# EAGLE design ECE411-Group6-V3 (EAGLE 8.3.2)
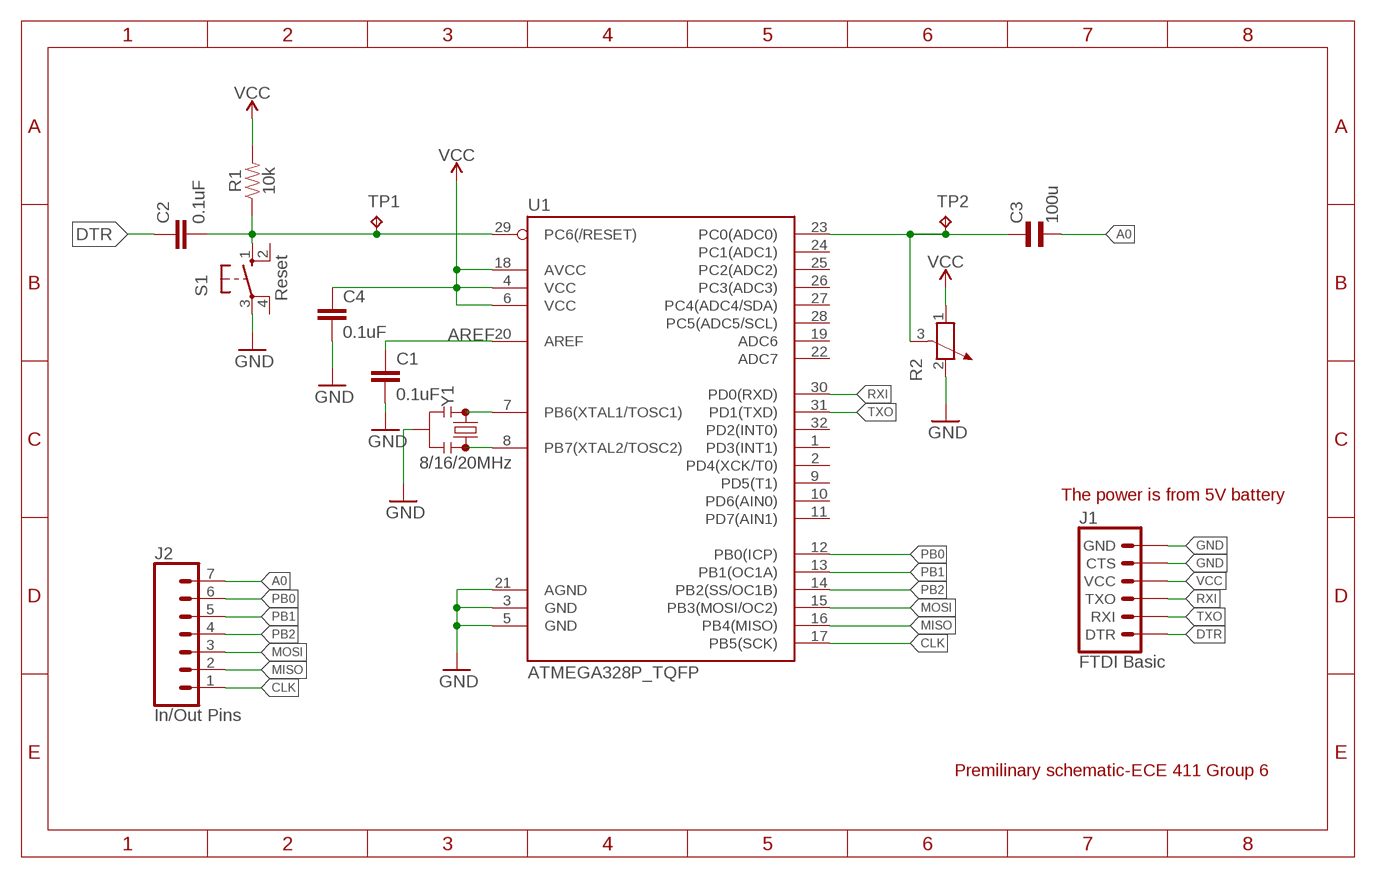
[diagram p0: schematic, sheet 1]

## Parts
C1  0.1uF  0.1UF-0603-25V-5%  [0603]
C2  0.1uF  0.1UF-0603-25V-5%  [0603]
C3  100u  EL-BI25-10AXIAL  [EU25-10]
C4  0.1uF  0.1UF-0603-25V-5%  [0603]
J1  FTDI Basic  6_PIN_SERIAL_TARGET  [1X06]
J2  In/Out Pins  CONN_07  [1X07]
R1  10k  10KOHM-0603-1/10W-1%  [0603]
R2  POTENTIOMETER_PT-10  [PT-10]
S1  Reset  10-XX  [B3F-10XX]
TP1  TPB1,27  [B1,27]
TP2  TPB1,27  [B1,27]
U1  ATMEGA328P_TQFP  [TQFP32-08]
Y1  8/16/20MHz  RESONATORSMD-3.2X1.3  [RESONATOR-SMD-3.2X1.3]

## Nets
A0: C3.2 J2.7
AREF: C1.1 U1.20(AREF)
CLK: J2.1 U1.17(PB5(SCK))
DTR: C2.1 J1.1(DTR)
GND: C1.2 C4.2 J1.5(CTS) J1.6(GND) R2.2 S1.3(P) U1.3(GND) U1.5(GND) U1.21(AGND) Y1.2
MISO: J2.2 U1.16(PB4(MISO))
MOSI: J2.3 U1.15(PB3(MOSI/OC2))
N$1: U1.7(PB6(XTAL1/TOSC1)) Y1.1
N$2: U1.8(PB7(XTAL2/TOSC2)) Y1.3
N$3: C2.2 R1.1 S1.1(S) TP1.TP U1.29(PC6(/RESET))
N$4: C3.1 R2.3 TP2.TP U1.23(PC0(ADC0))
PB0: J2.6 U1.12(PB0(ICP))
PB1: J2.5 U1.13(PB1(OC1A))
PB2: J2.4 U1.14(PB2(SS/OC1B))
RXI: J1.3(TXO) U1.30(PD0(RXD))
TXO: J1.2(RXI) U1.31(PD1(TXD))
VCC: C4.1 J1.4(VCC) R1.2 R2.1 U1.4(VCC) U1.6(VCC) U1.18(AVCC)
Unconnected: S1.2(S1) S1.4(P1) U1.1(PD3(INT1)) U1.2(PD4(XCK/T0)) U1.9(PD5(T1)) U1.10(PD6(AIN0)) U1.11(PD7(AIN1)) U1.19(ADC6) U1.22(ADC7) U1.24(PC1(ADC1)) U1.25(PC2(ADC2)) U1.26(PC3(ADC3)) U1.27(PC4(ADC4/SDA)) U1.28(PC5(ADC5/SCL)) U1.32(PD2(INT0))

## Notes on the sheet
- The power is from 5V battery
- Premilinary schematic-ECE 411 Group 6

## Library data of the parts
C1 C2 C4 = SparkFun-Capacitors:0.1UF: 0.1µF ceramic capacitors A capacitor is a passive two-terminal electrical component used to store electrical energy temporarily in an electric field.; PROD_ID: CAP-08604
C3 = rcl:EL-: BIPOLAR ELECTROLYTIC CAPACITOR
J1 = SparkFun-Connectors:6_PIN_SERIAL_TARGET: 6-pin header connection for use with the "FTDI BASIC" pinout - TARGET SIDE. Also known as "Arduino Serial Program Header". It is used to mate with our FTDI Basic serial programmers using the Arduino IDE. Note, this device has "TARGET" in the name. It is intended to be used on a design that contains a target micro-controller that you wish to program. The "sister" device, named "CABLE" is inteneded to be used on a design that usually lives on the end of your USB cable and prvides the converter chip (FTDI232 or FTDI231x) to commnicate serial RX/TX. You can populate with some of these: Break Away Headers - Straight <https://www.sparkfun.com/products/116> (PRT-00116) For reference (or to suit your programming needs) check out these designs: SparkFun FTDI Basic Breakout - 5V <https://www.sparkfun.com/products/9716> (DEV-09716) SparkFun FTDI Basic Breakout - 3.3V <https://www.sparkfun.com/products/9873> (DEV-09873) SparkFun FTDI SmartBasic <https://www.sparkfun.com/products/12935> (DEV-12935) SparkFun Beefy 3 - FTDI Basic Breakout <https://www.sparkfun.com/products/13746> (DEV-13746)
J2 = SparkFun-Connectors:CONN_07: Multi connection point. Often used as Generic Header-pin footprint for 0.1 inch spaced/style header connections On any of the 0.1 inch spaced packages, you can populate with these: Break Away Headers - Straight <https://www.sparkfun.com/products/116> (PRT-00116) Break Away Male Headers - Right Angle <https://www.sparkfun.com/products/553> (PRT-00553) Female Headers <https://www.sparkfun.com/products/115> (PRT-00115) Break Away Headers - Machine Pin <https://www.sparkfun.com/products/117> (PRT-00117) Break Away Female Headers - Swiss Machine Pin <https://www.sparkfun.com/products/743> (PRT-00743) For SCREWTERMINALS and SPRING TERMINALS visit here: Screw Terimnals on SparkFun.com <https://www.sparkfun.com/search/results?term=Screw+Terminals> (5mm/3.5mm/2.54mm spacing) This device is also useful as a general connection point to wire up your design to another part of your project. Our various solder wires solder well into these plated through hole pads. Hook-Up Wire - Assortment (Stranded, 22 AWG) <https://www.sparkfun.com/products/11375> (PRT-11375) Hook-Up Wire - Assortment (Solid Core, 22 AWG) <https://www.sparkfun.com/products/11367> (PRT-11367) View the entire wire category on our website here <https://www.sparkfun.com/categories/141> Special notes: Molex polarized connector foot print use with SKU : PRT-08231 with associated crimp pins and housings. 1MM SMD Version SKU: PRT-10208 NOTES ON THE VARIANTS LOCK and LOCK_LONGPADS... This footprint was designed to help hold the alignment of a through-hole component (i.e. 6-pin header) while soldering it into place. You may notice that each hole has been shifted either up or down by 0.005 of an inch from it's more standard position (which is a perfectly straight line). This slight alteration caused the pins (the squares in the middle) to touch the edges of the holes. Because they are alternating, it causes a "brace" to hold the component in place. 0.005 has proven to be the perfect amount of "off-center" position when using our standard breakaway headers. Although looks a little odd when you look at the bare footprint, once you have a header in there, the alteration is very hard to notice. Also,if you push a header all the way into place, it is covered up entirely on the bottom side.
R1 = SparkFun-Resistors:10KOHM: 10kΩ resistor A resistor is a passive two-terminal electrical component that implements electrical resistance as a circuit element. Resistors act to reduce current flow, and, at the same time, act to lower voltage levels within circuits. - Wikipedia; PROD_ID: RES-00824
R2 = rcl:POTENTIOMETER_: Potentiometer
S1 = switch-omron:10-XX: OMRON SWITCH; MPN: B3F-1000; OC_FARNELL: 176432; OC_NEWARK: 36M3542
TP1 TP2 = testpad:TP: Test pad
U1 = SparkFun-IC-Microcontroller:ATMEGA328P_TQFP: Popular 328P in QFP Storefront component: ATmega328 - TQFP <https://www.sparkfun.com/products/13448> (COM-13448) Datasheet <http://www.sparkfun.com/datasheets/Components/SMD/ATMega328.pdf> SparkFun Products SparkFun RedBoard - Programmed with Arduino <https://www.sparkfun.com/products/12757> (DEV-12757) Arduino Pro Mini 328 - 5V/16MHz <https://www.sparkfun.com/products/11113> (DEV-11113) Arduino Pro Mini 328 - 3.3V/8MHz <https://www.sparkfun.com/products/11114> (DEV-11114) SparkFun OpenLog <https://www.sparkfun.com/products/13712> (DEV-13712) SparkFun MicroView - OLED Arduino Module <https://www.sparkfun.com/products/12923> (DEV-12923) SparkFun Digital Sandbox <https://www.sparkfun.com/products/12651> (DEV-12651) SparkFun PicoBoard <https://www.sparkfun.com/products/11888> (WIG-11888) Arduino Fio <https://www.sparkfun.com/products/10116> (DEV-10116) LilyPad Arduino 328 Main Board <https://www.sparkfun.com/products/13342> (DEV-13342) SparkFun RedStick <https://www.sparkfun.com/products/13741> (DEV-13741) LilyPad MP3 <https://www.sparkfun.com/products/11013> (DEV-11013) LilyPad Arduino SimpleSnap <https://www.sparkfun.com/products/10941> (DEV-10941) SparkFun Stepoko <https://www.sparkfun.com/products/13899> (ROB-13899) SparkFun Geiger Counter <https://www.sparkfun.com/products/11345> (SEN-11345) SparkFun EL Sequencer <https://www.sparkfun.com/products/12781> (COM-12781) Arduino Pro 328 - 5V/16MHz <https://www.sparkfun.com/products/10915> (DEV-10915) CryptoCape <https://www.sparkfun.com/products/12773> (DEV-12773) SparkFun IR Thermometer Evaluation Board - MLX90614 <https://www.sparkfun.com/products/10740> (SEN-10740) SparkFun RedBot Mainboard <https://www.sparkfun.com/products/12097> (ROB-12097) Arduino Pro 328 - 3.3V/8MHz <https://www.sparkfun.com/products/10914> (DEV-10914) SparkFun Block for Intel® Edison - Arduino <https://www.sparkfun.com/products/13036> (DEV-13036) SparkFun Simon Says - Surface Mount Soldering Kit <https://www.sparkfun.com/products/10935> (KIT-10935) SparkFun 7-Segment Serial Display - Red <https://www.sparkfun.com/products/11441> (COM-11441) SparkFun 7-Segment Serial Display - White <https://www.sparkfun.com/products/11629> (COM-11629) SparkFun 7-Segment Serial Display - Yellow <https://www.sparkfun.com/products/11443> (COM-11443) SparkFun 7-Segment Serial Display - Kelly Green <https://www.sparkfun.com/products/11440> (COM-11440) SparkFun 7-Segment Serial Display - Blue <https://www.sparkfun.com/products/11442> (COM-11442) SparkFun OpenSegment Serial Display - 20mm (Blue) <https://www.sparkfun.com/products/11647> (COM-11647) SparkFun OpenSegment Serial Display - 20mm (Green) <https://www.sparkfun.com/products/11646> (COM-11646) SparkFun OpenSegment Serial Display - 20mm (White) <https://www.sparkfun.com/products/11648> (COM-11648) SparkFun OpenSegment Serial Display - 20mm (Red) <https://www.sparkfun.com/products/11644> (COM-11644) SparkFun OpenSegment Serial Display - 20mm (Yellow) <https://www.sparkfun.com/products/11645> (COM-11645) SparkFun OpenSegment Shield <https://www.sparkfun.com/products/13190> (DEV-13190); PROD_ID: IC-09069
Y1 = SparkFun-Clocks:RESONATOR: Resonators (Generic) Ceramic resonators are clock-generating components, often used to control timing in microcontrollers. They usually have 3 pins: two pins for oscillation, and one pin for ground. Compared to crystals, resonators have worse tolerance, but are usually much cheaper. Plus, they have built-in load capacitors! These devices are used on boards like the Arduino Pro 8MHz <https://www.sparkfun.com/products/11114> and Arduino Pro 16MHz <https://www.sparkfun.com/products/11113>.

## Board
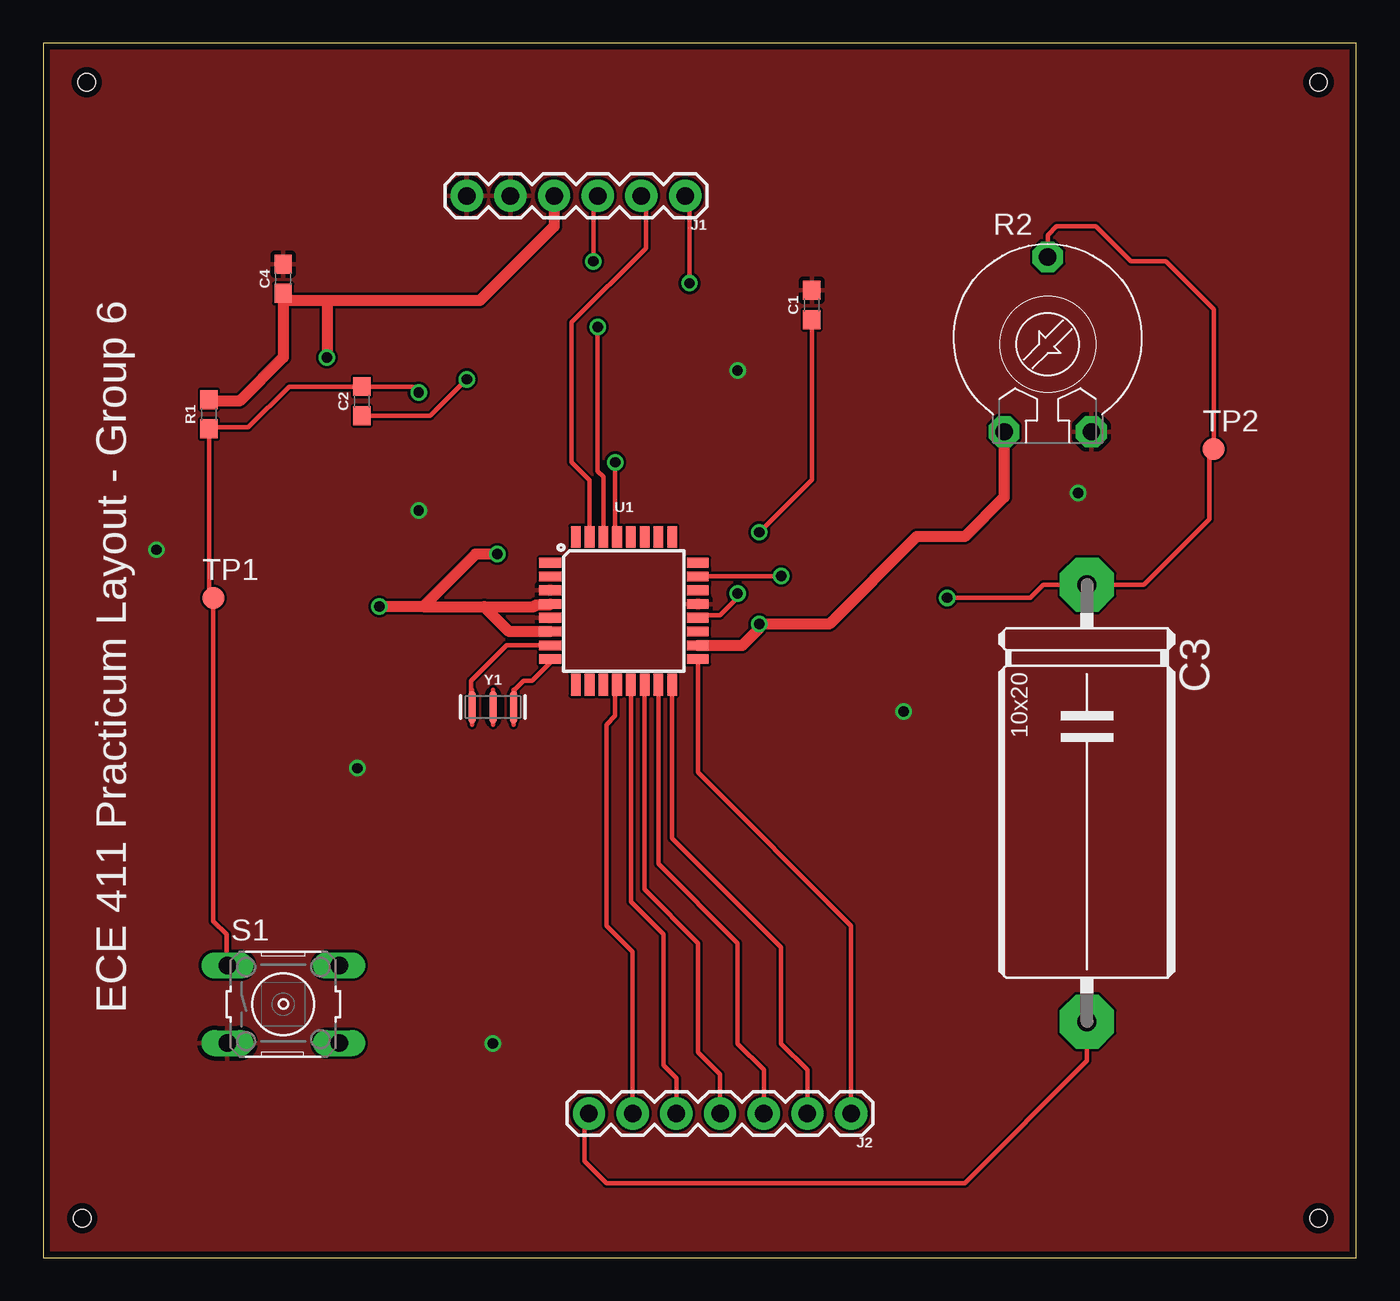
[diagram p1: board, top side]
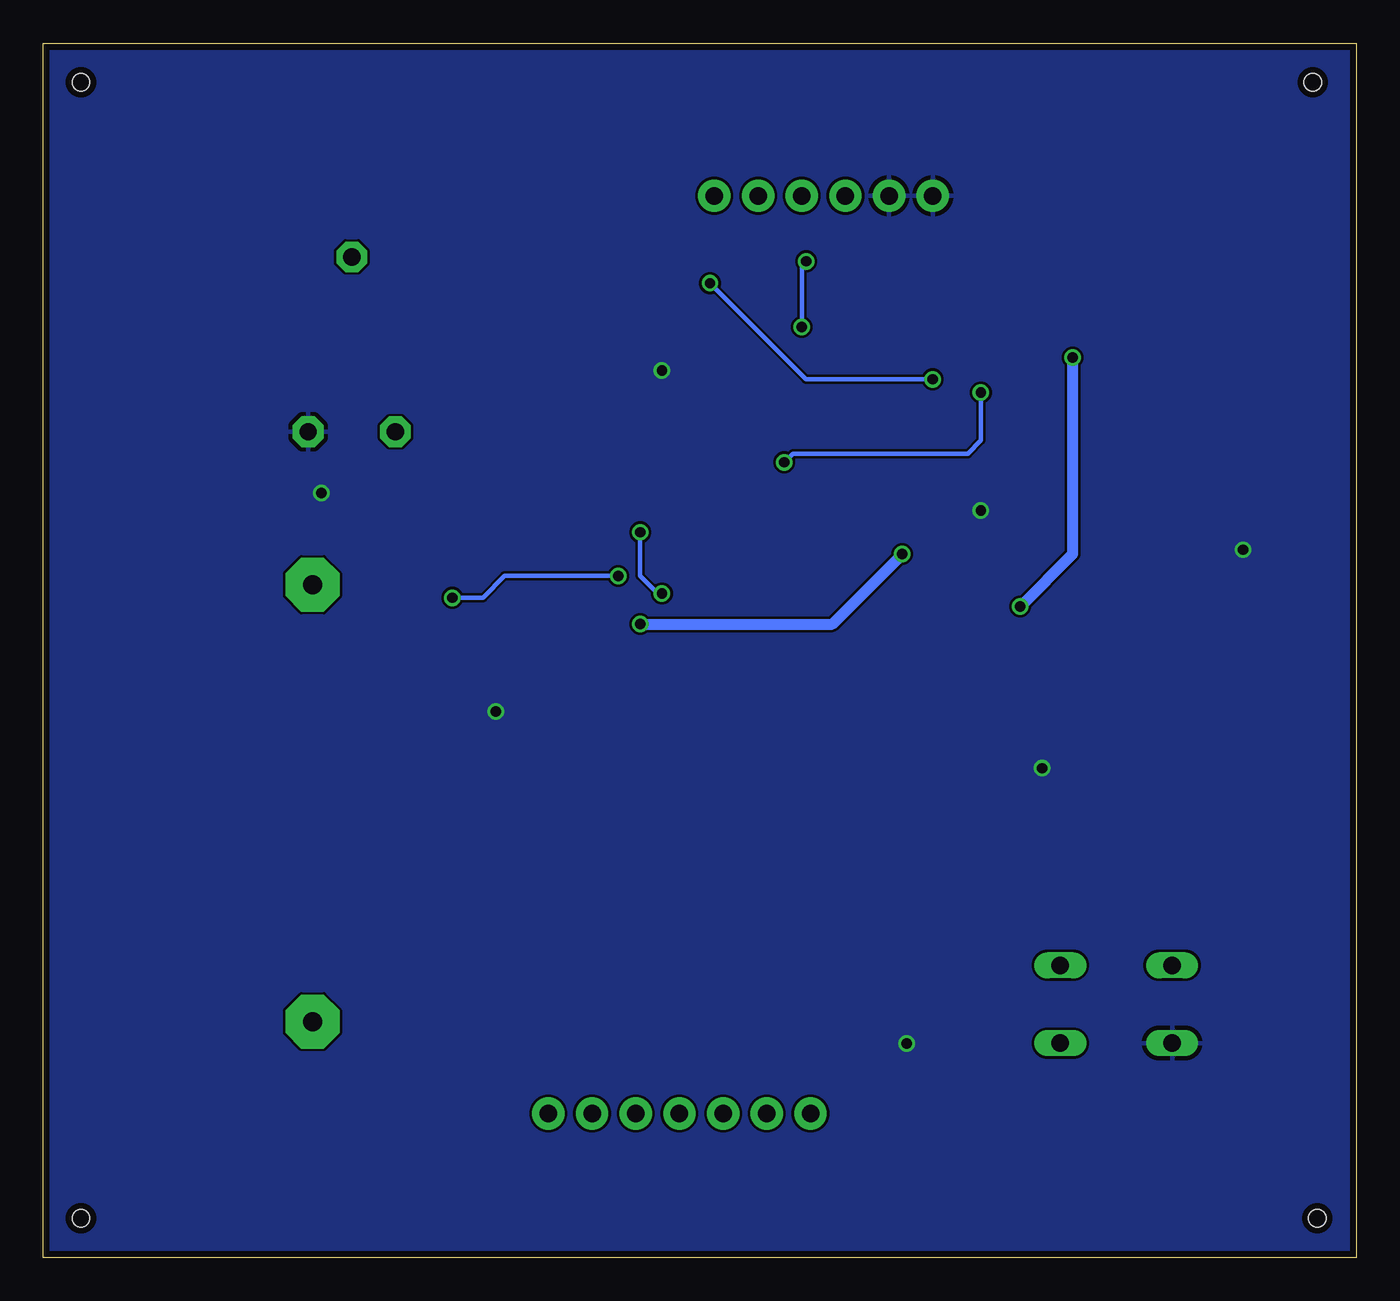
[diagram p2: board, bottom side, seen from below]

Size 76.38 x 70.6 mm. Coordinates in mm from the lower left corner, seen from the top.
Outline: 0,0 76.38,0 76.38,70.6 0,70.6 0,0
Copper layers (1*16): Top 0.0356mm / dielectric 1.5011mm / Bottom 0.0356mm
Design rules "osh-park-2-layers-design-rules": minimum track width 6mil, minimum drill 10mil, track to track 6mil, track to pad 6mil, pad to pad 6mil, via to via 6mil, smd to smd 6mil, copper to edge 15mil, drill to drill 6mil, minimum pad ring 7mil, minimum via ring 7mil, stop-mask expansion 3mil, vias tented up to drill 0mil, thermal gap 10mil
Holes 1 mm at 2.54,68.33 2.29,2.29 74.17,2.29 74.17,68.33

### Footprints (pad centres in the part's own frame; a part is rotated, then mirrored left to right if it is on the bottom)
0603 = smd 1.1 x 1: 1 -0.85,0; 2 0.85,0
EU25-10 = drill 1.118 pad 3.15 octagon: 1 -12.7,0; 2 12.7,0
1X06 = drill 1.016 pad 1.88: 1 0,0; 2 2.54,0; 3 5.08,0; 4 7.62,0; 5 10.16,0; 6 12.7,0
1X07 = drill 1.016 pad 1.88: 1 0,0; 2 2.54,0; 3 5.08,0; 4 7.62,0; 5 10.16,0; 6 12.7,0; 7 15.24,0
PT-10 = drill 1.016 pad 1.778 octagon: 1 -2.54,-5.08; 2 2.54,-5.08; 3 0,5.08
B3F-10XX = drill 1.016 long: 1 -3.251,2.261; 2 3.251,2.261; 3 -3.251,-2.261; 4 3.251,-2.261
B1,27 = smd 1.27 x 1.27: TP 0,0
TQFP32-08 = smd 1.27 x 0.559: 1 -4.293,2.8; 2 -4.293,2; 3 -4.293,1.2; 4 -4.293,0.4; 5 -4.293,-0.4; 6 -4.293,-1.2; 7 -4.293,-2; 8 -4.293,-2.8; 17 4.293,-2.8; 18 4.293,-2; 19 4.293,-1.2; 20 4.293,-0.4; 21 4.293,0.4; 22 4.293,1.2; 23 4.293,2; 24 4.293,2.8 | smd 0.559 x 1.27: 9 -2.8,-4.293; 10 -2,-4.293; 11 -1.2,-4.293; 12 -0.4,-4.293; 13 0.4,-4.293; 14 1.2,-4.293; 15 2,-4.293; 16 2.8,-4.293; 25 2.8,4.293; 26 2,4.293; 27 1.2,4.293; 28 0.4,4.293; 29 -0.4,4.293; 30 -1.2,4.293; 31 -2,4.293; 32 -2.8,4.293
RESONATOR-SMD-3.2X1.3 = smd 0.45 x 1.905: 1 -1.2,0; 2 0,0; 3 1.2,0

### Placement (x,y rotation side)
C1  44.7,55.37 90 top
C2  18.54,49.78 90 top
C3  60.71,26.42 270 top
C4  13.97,56.9 90 top
J1  37.34,61.72 180 top
J2  46.99,8.38 180 top
R1  9.65,49.02 90 top
R2  58.42,53.09 0 top
S1  13.97,14.73 0 top
TP1  9.91,38.35 0 top
TP2  68.07,46.99 0 top
U1  33.78,37.59 0 top
Y1  26.16,32 0 top

### Tracks (layer width: path | path; a pad name or v marks a point on that pad's centre or on a via)
A0
  Top 0.254: C3.2 60.71,11.43 53.59,4.32 32.77,4.32 31.5,5.59 31.5,8.13 J2.7
AREF  (via drill 0.6)
  Top 0.254: C1.1 44.7,45.21 v41.66,42.16 | v40.39,38.61 40.39,38.35 39.37,37.34 38.22,37.34 U1.20
  Bottom 0.254: v41.66,42.16 41.66,39.62 40.64,38.61 v40.39,38.61
CLK
  Top 0.254: U1.17 38.08,28.22 46.99,19.3 J2.1
DTR  (via drill 0.6)
  Top 0.254: C2.1 22.52,48.93 v24.64,51.05 | v37.59,56.64 37.59,61.47 J1.1
  Bottom 0.254: v24.64,51.05 32,51.05 v37.59,56.64
GND  (via drill 0.6)
  other vias: 6.6,41.15 21.84,43.43 18.29,28.45 50.04,31.75 60.2,44.45 40.39,51.56 26.16,12.45
  pour Top: -0.51,71.12 -0.51,-0.51 76.96,-0.51 76.96,71.12
  pour Bottom: -0.51,71.12 -0.51,-0.51 76.96,-0.51 76.96,71.12
MISO
  Top 0.254: U1.16 36.58,24.38 42.93,18.03 42.93,12.45 44.45,10.92 J2.2
MOSI
  Top 0.254: U1.15 35.78,22.89 40.39,18.29 40.39,12.45 41.91,10.92 J2.3
N$1
  Top 0.254: U1.7 26.96,35.59 24.89,33.53 24.89,32.07 Y1.1
N$2
  Top 0.254: U1.8 29.49,34.57 28.45,33.53 27.94,33.53 27.43,33.02 27.43,32.07 Y1.3
N$3  (via drill 0.6)
  Top 0.254: S1.1 10.67,17.04 10.67,18.8 9.91,19.56 TP1.TP 9.65,38.61 R1.1 9.74,48.26 11.94,48.26 14.31,50.63 C2.2 21.5,50.63 v21.84,50.29 | v33.27,46.23 33.27,41.99 U1.29
  Bottom 0.254: v21.84,50.29 21.84,47.5 22.61,46.74 32.77,46.74 v33.27,46.23
N$4  (via drill 0.6)
  Top 0.254: U1.23 42.64,39.59 42.67,39.62 v42.93,39.62 | v52.58,38.35 57.4,38.35 58.17,39.12 C3.1 64.01,39.12 67.82,42.93 67.82,46.74 TP2.TP 68.07,55.12 65.28,57.91 63.25,57.91 61.21,59.94 58.93,59.94 58.42,59.44 R2.3
  Bottom 0.254: v42.93,39.62 49.53,39.62 50.8,38.35 v52.58,38.35
PB0
  Top 0.254: J2.6 34.29,17.78 32.77,19.3 32.77,30.99 33.27,31.5 33.27,33.19 U1.12
PB1
  Top 0.254: U1.13 34.18,20.68 36.07,18.8 36.07,11.18 36.83,10.41 J2.5
PB2
  Top 0.254: U1.14 34.98,21.41 38.1,18.29 38.1,11.94 39.37,10.67 J2.4
RXI  (via drill 0.6)
  Top 0.254: U1.30 32.58,45.4 32.26,45.72 v32.26,54.1 | v32,57.91 32,61.47 J1.3
  Bottom 0.254: v32.26,54.1 32.26,57.66 v32,57.91
TXO
  Top 0.254: U1.31 31.78,45.18 30.73,46.23 30.73,54.36 35.05,58.67 35.05,61.47 J1.2
VCC  (via drill 0.6)
  Top 0.635: R1.2 9.74,49.78 11.43,49.78 13.97,52.32 C4.1 14.39,55.63 16.51,55.63 | J1.4 29.72,59.94 25.4,55.63 16.51,55.63 | 16.51,55.63 v16.51,52.32 | 22.1,37.85 25.65,37.85 | 22.1,37.85 v19.56,37.85 | 25.65,37.85 28.56,37.85 28.66,37.94 29.44,37.94 U1.4 | U1.6 27.11,36.39 25.65,37.85 | U1.18 40.67,35.59 41.66,36.58 v41.66,36.83 45.72,36.83 50.8,41.91 53.59,41.91 55.88,44.2 R2.1 | v26.42,40.89 25.15,40.89 22.1,37.85
  Bottom 0.635: v16.51,52.32 16.51,40.89 v19.56,37.85 | v41.66,36.83 30.48,36.83 v26.42,40.89

### Text on the board
tPlace: ECE 411 Practicum Layout - Group 6